# Altium schematic sheet ATTINY214-SSNR.SchDoc
size A
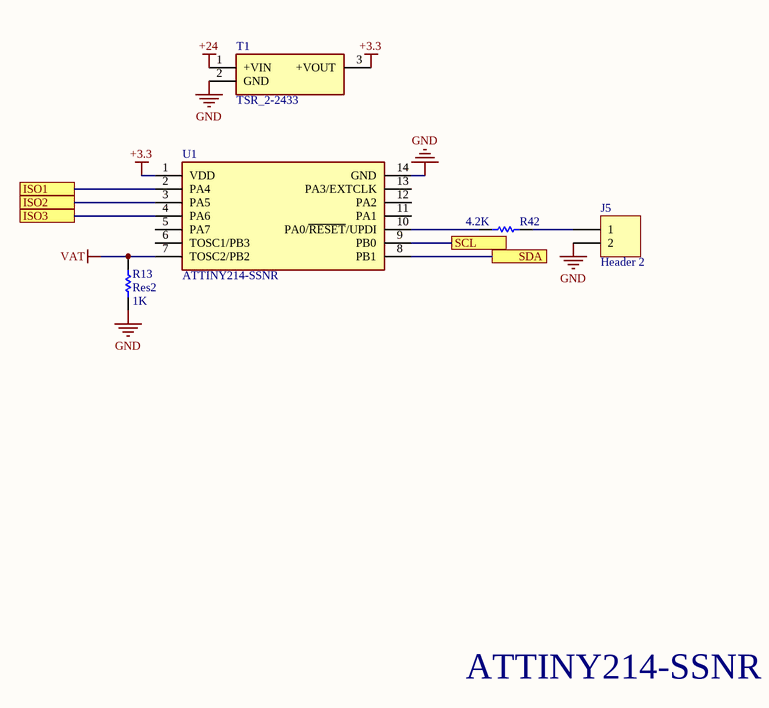
[diagram p0: ATTINY214-SSNR.SchDoc]

## Parts
J5  Header 2  [HDR1X2]
R13  Res2  value 1K  [0402]
R42  value 4.2K  [0402]  (hidden comment: Res10)
T1  TSR_2-2433  [TSR_2-2433]
U1  ATTINY214-SSNR  [SOIC127P600X175-14N]

## Ports
ISO1, ISO2, ISO3, SCL, SDA

## Nets
+3.3: T1.3(+VOUT) U1.1(VDD)
+24: T1.1(+VIN)
GND: J5.2 R13.1 T1.2(GND) U1.14(GND)
VAT: R13.2 U1.7(TOSC2/PB2)
ISO1: U1.2(PA4) ; port ISO1
ISO2: U1.3(PA5) ; port ISO2
ISO3: U1.4(PA6) ; port ISO3
SCL: U1.9(PB0) ; port SCL
SDA: U1.8(PB1) ; port SDA
NetJ5_1: J5.1 R42.2
NetR42_1: R42.1 U1.10(PA0/~{RESET}/UPDI)

Not connected (* = marked no-connect by the designer): U1 5(PA7) 6(TOSC1/PB3) 11(PA1) 12(PA2) 13(PA3/EXTCLK)

## Notes on the sheet
- ATTINY214-SSNR

## Library data of the parts
J5 = Header 2: Header, 2-Pin; LatestRevisionDate: 17-Jul-2002; LatestRevisionNote: Re-released for DXP Platform.; Publisher: Altium Limited
R13 R42 = Res1: Resistor; Published: 8-Jun-2000; LatestRevisionDate: 17-Jul-2002; LatestRevisionNote: Re-released for DXP Platform.; PackageReference: AXIAL-0.3; Publisher: Altium Limited; PackageDescription: Axial Device, Thru-Hole; 2 Leads; 0.3 in Pin Spacing
T1 = TSR_2-2433: Transformer; Manufacturer_Name: Traco Power; Manufacturer_Part_Number: TSR 2-2433; Allied_Number: 71066182; Datasheet Link: http://assets.tracopower.com/20170228093640/TSR2/documents/tsr2-datasheet.pdf; Mouser Part Number: 495-TSR2-2433; Mouser Price/Stock: https://www.mouser.com/Search/Refine.aspx?Keyword=495-TSR2-2433; RS Part Number: 9068478P; RS Price/Stock: http://uk.rs-online.com/web/p/products/9068478P; Allied Price/Stock: https://www.alliedelec.com/tracopower-tsr-2-2433/71066182/
U1 = ATTINY214-SSNR: Undefined or Miscellaneous; Manufacturer_Name: Microchip; Datasheet Link: http://ww1.microchip.com/downloads/en/DeviceDoc/40001912A.pdf; Height: 1.75mm; Manufacturer_Part_Number: ATTINY214-SSNR; Mouser Part Number: 579-ATTINY214-SSNR; Mouser Price/Stock: https://www.mouser.com/Search/Refine.aspx?Keyword=579-ATTINY214-SSNR